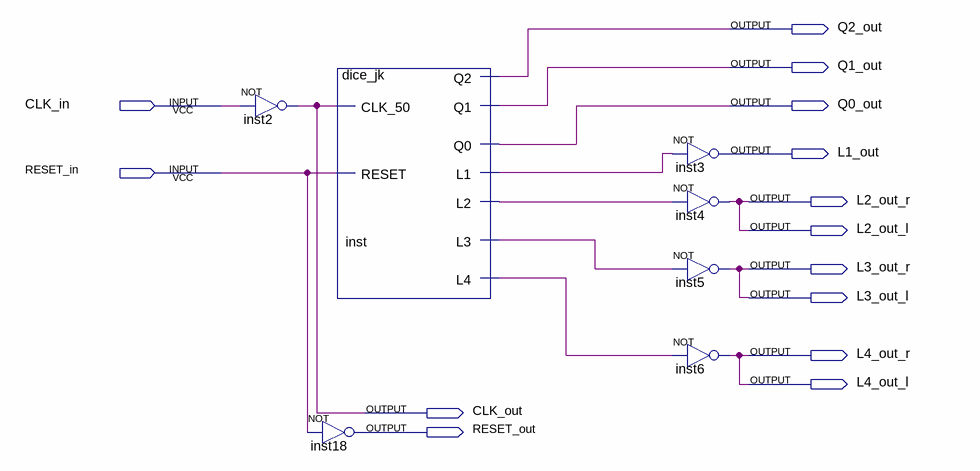
[diagram p0: schematic sheet]
// Quartus schematic dice_jk_interface.bdf as structural Verilog: 7 symbols, 14 pins
module dice_jk_interface (
  input  CLK_in,
  input  RESET_in,
  output Q2_out,
  output Q1_out,
  output Q0_out,
  output L1_out,
  output L2_out_r,
  output L2_out_l,
  output L3_out_r,
  output L3_out_l,
  output L4_out_r,
  output L4_out_l,
  output CLK_out,
  output RESET_out
);

  wire inst_l1, inst_l2, inst_l3, inst_l4;

  not inst2 (CLK_out, CLK_in);
  dice_jk inst (
    .CLK_50(CLK_out), .RESET(RESET_in), .Q2(Q2_out), .Q1(Q1_out), .Q0(Q0_out), .L1(inst_l1), .L2(inst_l2),
    .L3(inst_l3), .L4(inst_l4));
  not inst18 (RESET_out, RESET_in);
  not inst3 (L1_out, inst_l1);
  not inst4 (L2_out_l, inst_l2);
  not inst5 (L3_out_l, inst_l3);
  not inst6 (L4_out_l, inst_l4);

  assign L2_out_r = L2_out_l;
  assign L3_out_r = L3_out_l;
  assign L4_out_r = L4_out_l;
endmodule
